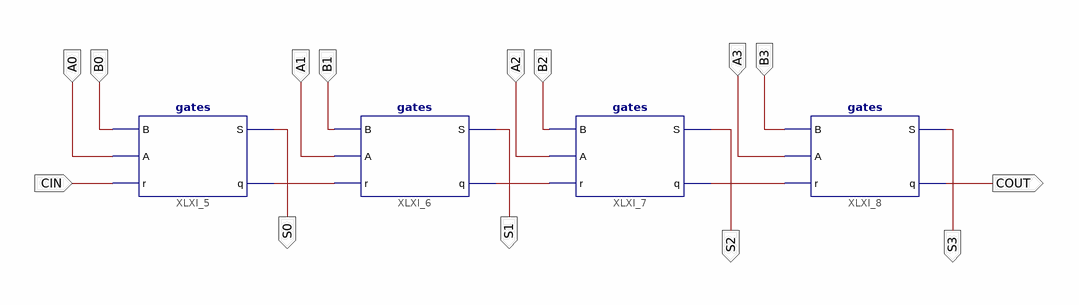
[diagram p0: schematic sheet 1]
// Xilinx ISE schematic fourbits.sch (spartan3e) as structural Verilog: 4 symbols, 14 ports
module fourbits (
  input  CIN,
  input  A0,
  input  B0,
  input  A1,
  input  B1,
  input  A2,
  input  B2,
  input  A3,
  input  B3,
  output S0,
  output COUT,
  output S1,
  output S3,
  output S2
);

  wire XLXN_1, XLXN_2, XLXN_3;

  gates XLXI_5 (.B(B0), .A(A0), .r(CIN), .q(XLXN_1), .S(S0));
  gates XLXI_6 (.B(B1), .A(A1), .r(XLXN_1), .q(XLXN_2), .S(S1));
  gates XLXI_7 (.B(B2), .A(A2), .r(XLXN_2), .q(XLXN_3), .S(S2));
  gates XLXI_8 (.B(B3), .A(A3), .r(XLXN_3), .q(COUT), .S(S3));
endmodule
